# EAGLE design new_design (EAGLE 6.4)
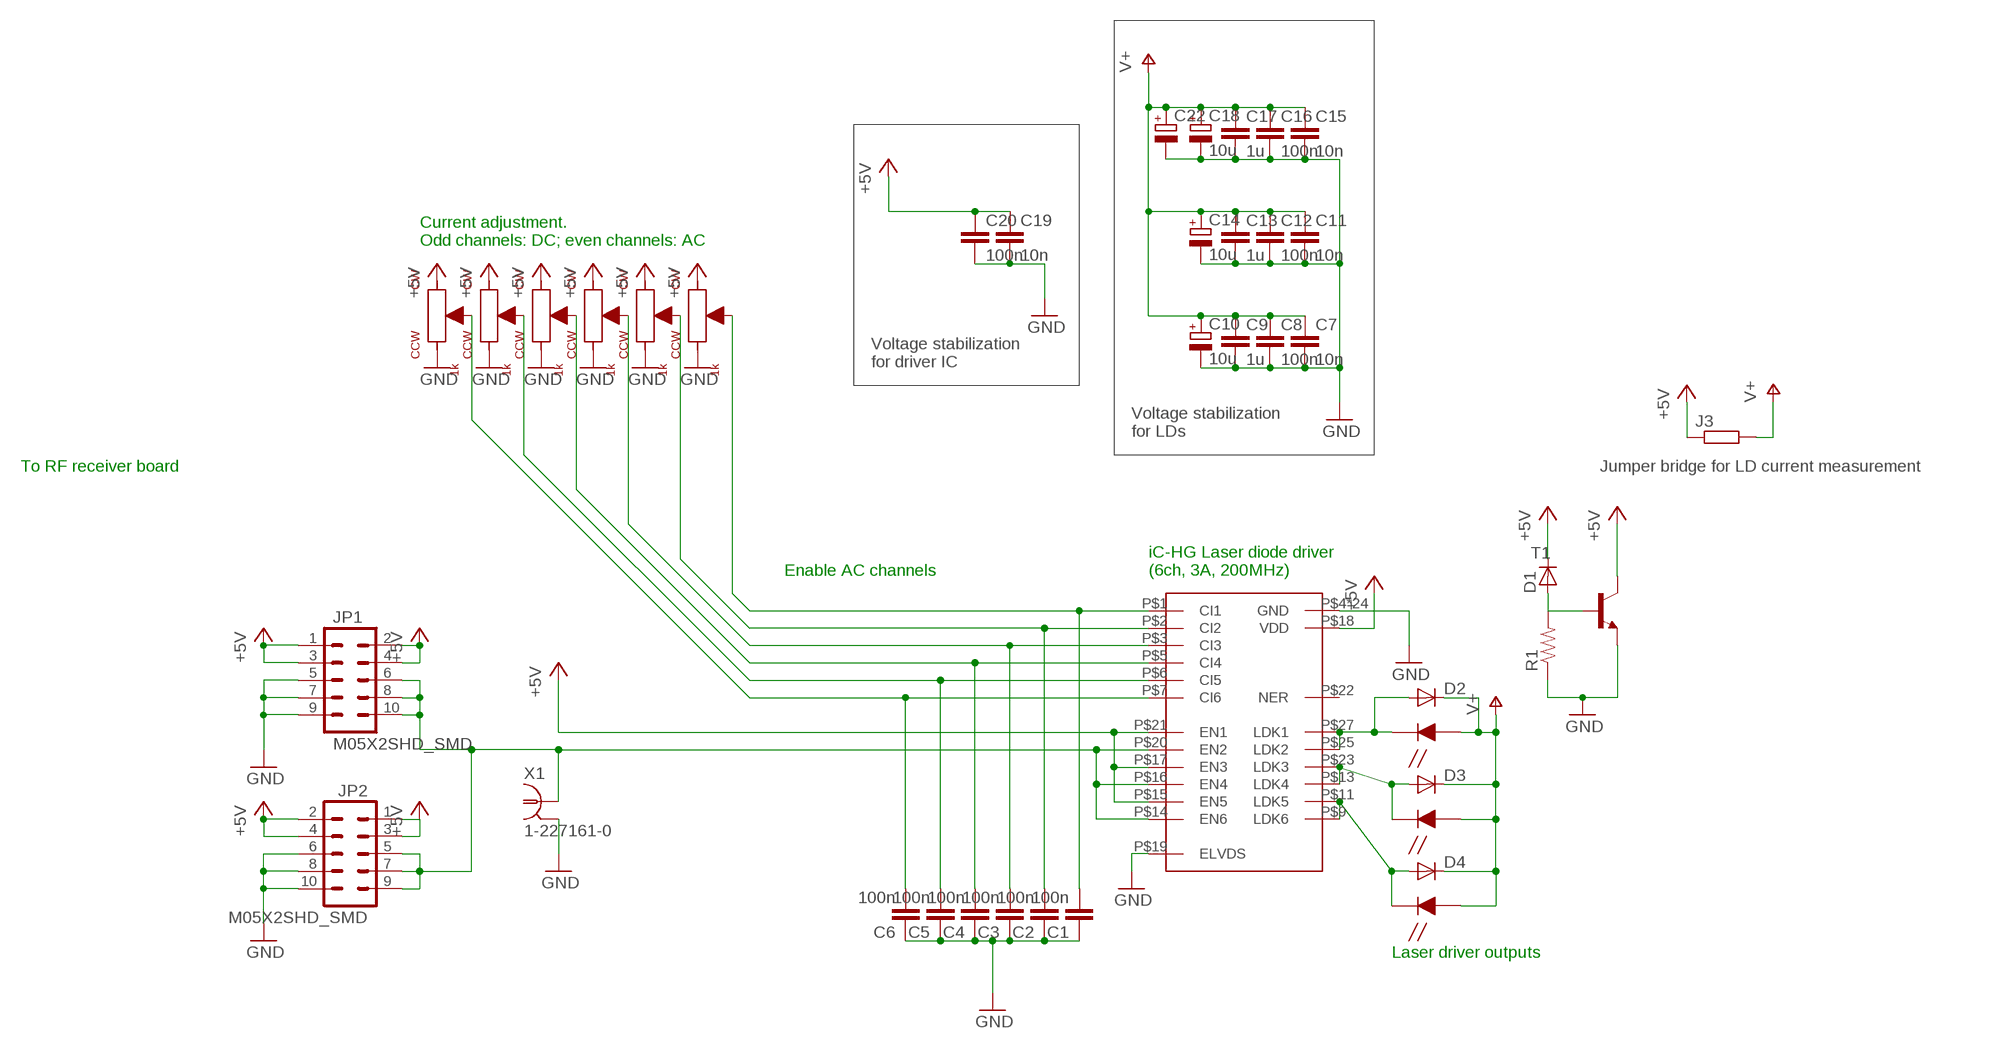
[diagram p0: schematic, sheet 1]

## Parts
C1  100n  C-EUC0402K  [C0402K]
C2  100n  C-EUC0402K  [C0402K]
C3  100n  C-EUC0402K  [C0402K]
C4  100n  C-EUC0402K  [C0402K]
C5  100n  C-EUC0402K  [C0402K]
C6  100n  C-EUC0402K  [C0402K]
C7  10n  C-EUC0402K  [C0402K]
C8  100n  C-EUC0402K  [C0402K]
C9  1u  C-EUC0603  [C0603]
C10  10u  CPOL-EUSMCB  [SMC_B]
C11  10n  C-EUC0402K  [C0402K]
C12  100n  C-EUC0402K  [C0402K]
C13  1u  C-EUC0603  [C0603]
C14  10u  CPOL-EUSMCB  [SMC_B]
C15  10n  C-EUC0402K  [C0402K]
C16  100n  C-EUC0402K  [C0402K]
C17  1u  C-EUC0603  [C0603]
C18  10u  CPOL-EUSMCB  [SMC_B]
C19  10n  C-EUC0402K  [C0402K]
C20  100n  C-EUC0402K  [C0402K]
C22  CPOL-EUCT7343  [CT7343]
D1  D-SMB  [SMB]
D2  DIODE-SOD523  [SOD523]
D3  DIODE-SOD523  [SOD523]
D4  DIODE-SOD523  [SOD523]
IC1  IC-HGTHERMAL  [QFN28-PAD]
J3  R-EU_R1210  [R1210]
JP1  M05X2SHD_SMD  [2X5-SHROUDED_SMD]
JP2  M05X2SHD_SMD  [2X5-SHROUDED_SMD]
LD1  LASER  [LD-FLAT]
LD2  LASER  [LD-FLAT]
LD3  LASER  [LD-FLAT]
P1  1k  TRIMMERPANASONIC_EVM1D  [EVM-1D]
P2  1k  TRIMMERPANASONIC_EVM1D  [EVM-1D]
P3  1k  TRIMMERPANASONIC_EVM1D  [EVM-1D]
P4  1k  TRIMMERPANASONIC_EVM1D  [EVM-1D]
P5  1k  TRIMMERPANASONIC_EVM1D  [EVM-1D]
P6  1k  TRIMMERPANASONIC_EVM1D  [EVM-1D]
R1  RESISTOR0805-RES  [0805]
T1  -NPN-SOT223  [SOT223]
X1  1-227161-0  [AMP_227161]

## Nets
+5V: C19.1 C20.1 D1.1(C) IC1.P$15(EN5) IC1.P$17(EN3) IC1.P$18(VDD) IC1.P$21(EN1) J3.1 JP1.1 JP1.2 JP1.3 JP1.4 JP2.1 JP2.2 JP2.3 JP2.4 P1.CW P2.CW P3.CW P4.CW P5.CW P6.CW T1.4(C)
AC_EN: IC1.P$14(EN6) IC1.P$16(EN4) IC1.P$20(EN2) JP1.6 JP1.8 JP1.10 JP2.5 JP2.7 JP2.9 X1.1
GND: C1.1 C2.1 C3.1 C4.1 C5.1 C6.1 C7.2 C8.2 C9.2 C10.- C11.2 C12.2 C13.2 C14.- C15.2 C16.2 C17.2 C18.- C19.2 C20.2 C22.- IC1.P$4(GND) IC1.P$8(GND) IC1.P$10(GND) IC1.P$12(GND) IC1.P$19(ELVDS) IC1.P$24(GND) IC1.P$26(GND) IC1.P$28(GND) IC1.P$29(GND) IC1.P$30(GND) IC1.P$31(GND) IC1.P$32(GND) IC1.P$33(GND) IC1.P$34(GND) IC1.P$35(GND) IC1.P$36(GND) IC1.P$37(GND) IC1.P$38(GND) IC1.P$39(GND) IC1.P$40(GND) IC1.P$41(GND) IC1.P$42(GND) IC1.P$43(GND) IC1.P$44(GND) IC1.P$45(GND) JP1.5 JP1.7 JP1.9 JP2.6 JP2.8 JP2.10 P1.CCW P2.CCW P3.CCW P4.CCW P5.CCW P6.CCW R1.1 T1.3(E) X1.2
N$1: C2.2 IC1.P$2(CI2) P2.W
N$2: C4.2 IC1.P$5(CI4) P4.W
N$3: C6.2 IC1.P$7(CI6) P6.W
N$5: C1.2 IC1.P$1(CI1) P1.W
N$7: C3.2 IC1.P$3(CI3) P3.W
N$9: C5.2 IC1.P$6(CI5) P5.W
N$11: D4.A IC1.P$9(LDK6) IC1.P$11(LDK5) LD3.C
N$12: D3.A IC1.P$13(LDK4) IC1.P$23(LDK3) LD2.C
N$13: D2.A IC1.P$25(LDK2) IC1.P$27(LDK1) LD1.C
N$14: D1.2(A) R1.2 T1.1(B)
V+: C7.1 C8.1 C9.1 C10.+ C11.1 C12.1 C13.1 C14.+ C15.1 C16.1 C17.1 C18.+ C22.+ D2.C D3.C D4.C J3.2 LD1.A LD2.A LD3.A
Unconnected: IC1.P$22(NER)

## Notes on the sheet
- Current adjustment. 
  Odd channels: DC; even channels: AC
- Voltage stabilization 
  for driver IC
- Voltage stabilization 
  for LDs
- To RF receiver board | Jumper bridge for LD current measurement
- Enable AC channels
- iC-HG Laser diode driver
  (6ch, 3A, 200MHz)
- Laser driver outputs

## Library data of the parts
C1-C9 C11-C13 C15-C17 C19 C20 = rcl:C-EU: CAPACITOR, European symbol
C10 C14 C18 C22 = rcl:CPOL-EU: POLARIZED CAPACITOR, European symbol
D1 = semicon-smd-ipc:D-: DIODE unfilled
D2-D4 = diode:DIODE-: DIODE
IC1 = clockbuffers:IC-HG
J3 = rcl:R-EU_: RESISTOR, European symbol
JP1 JP2 = SparkFun-Connectors_2:M05X2: Header 5x2 Standard 10-pin dual row 0.1" header. Commonly used with AVR-ISP. Use with Spark Fun Electronics SKU: PRT-00778
LD1-LD3 = clockbuffers:LASER
P1-P6 = clockbuffers:TRIMMER
R1 = SparkFun-Resistors:RESISTOR: Resistor Basic schematic elements and footprints for 0603, 1206, and PTH resistors.
T1 = transistor-neu-to92:*-NPN-: NPN Transistror
X1 = con-coax:?227161*: JACK, RIGHT ANGLE, 50 OHM, PCB, BNC Source: amp_227161.pdf; MF: TYCO ELECTRONICS; MPN: 1-227161; OC_FARNELL: unknown; OC_NEWARK: 33B3200

## Board
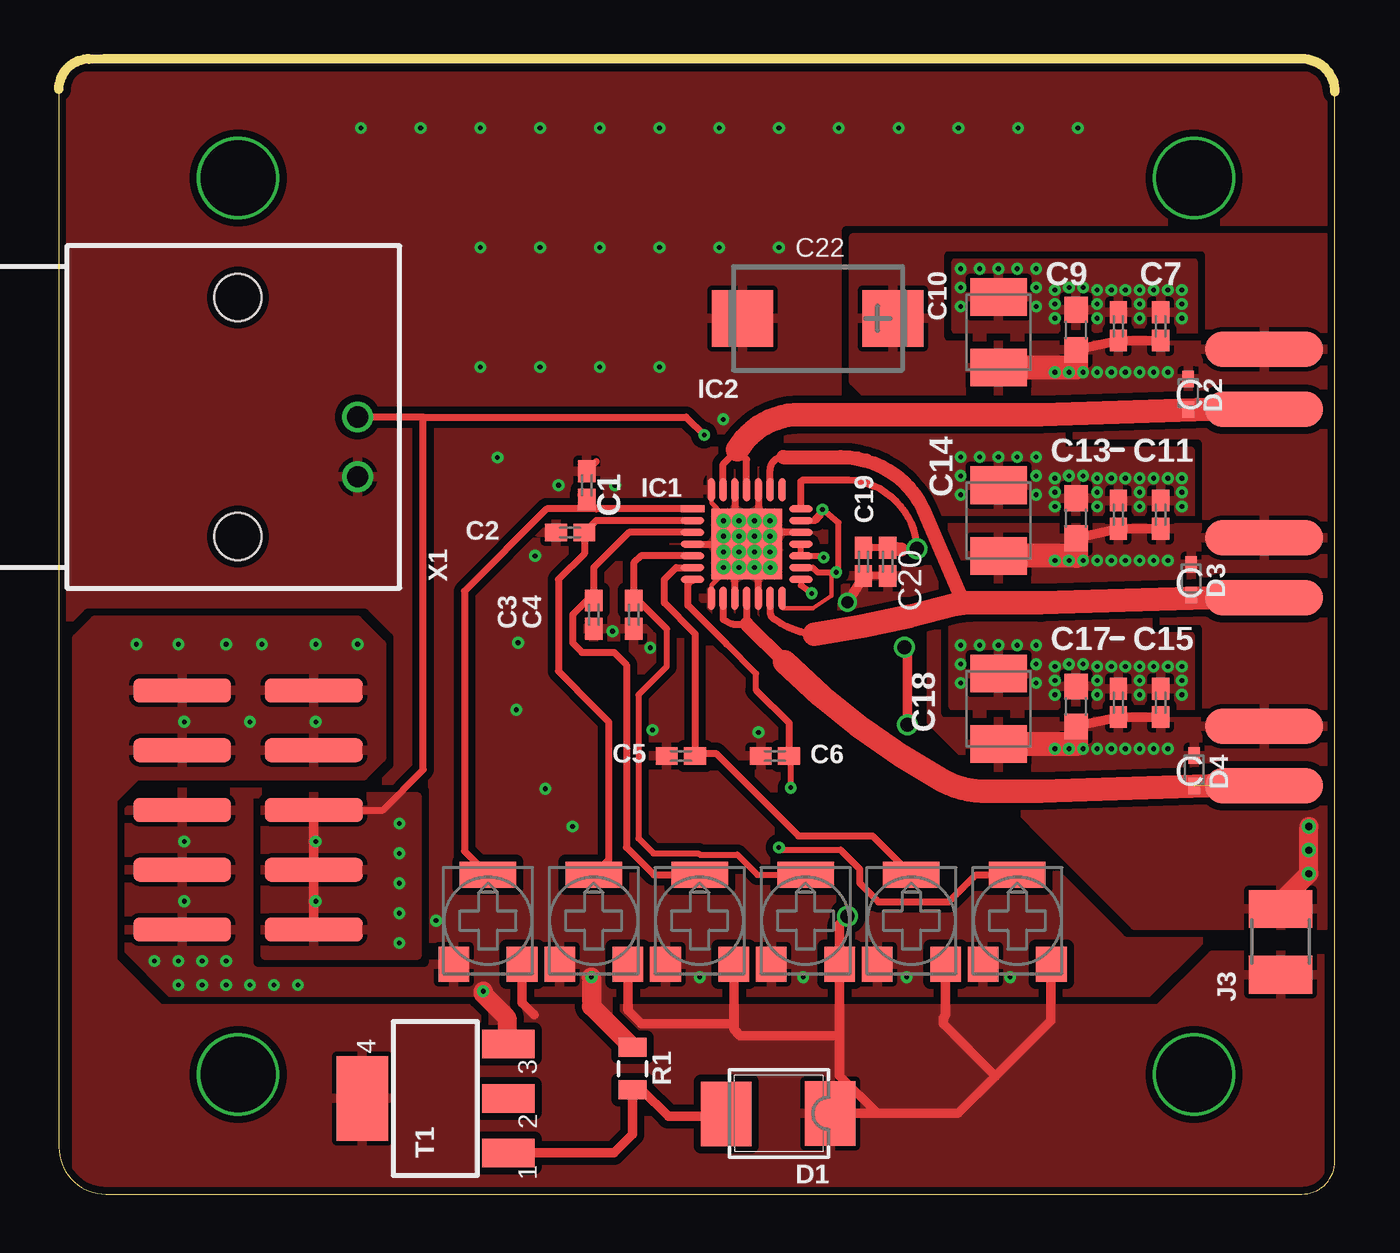
[diagram p1: board, top side]
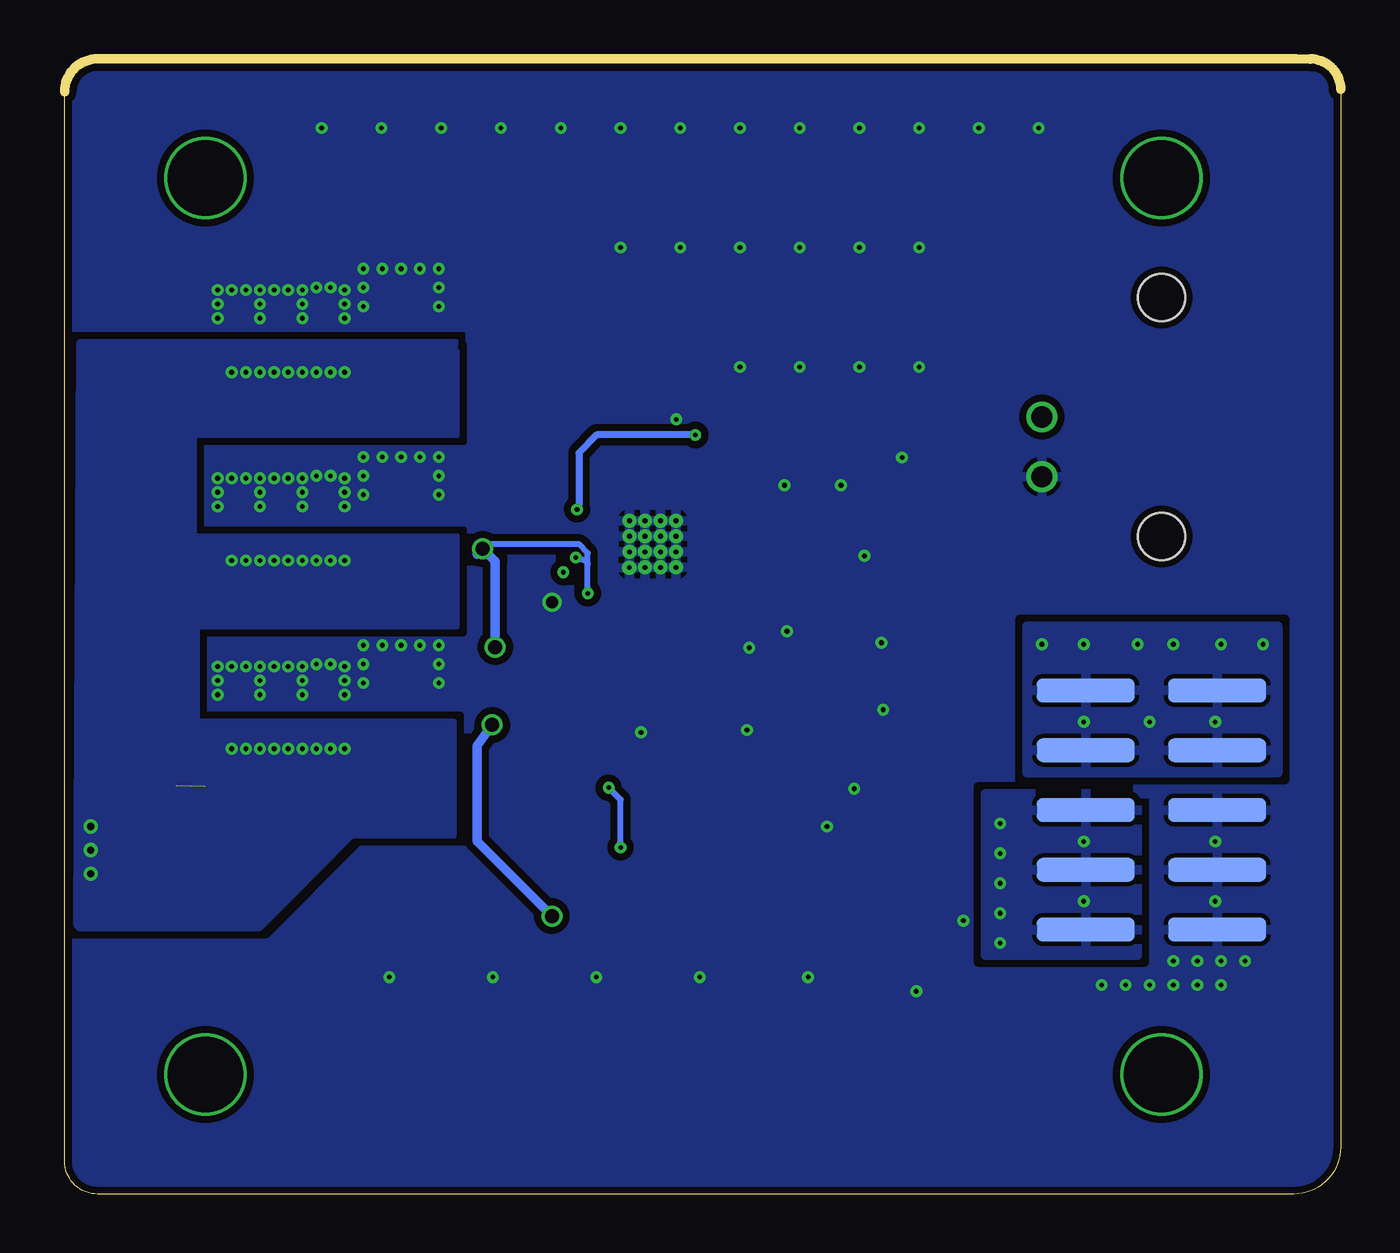
[diagram p2: board, bottom side, seen from below]

Size 54.24 x 48.24 mm. Coordinates in mm from the lower left corner, seen from the top.
Outline: 52.84,48.24 arc-90 54.24,46.84 54.24,1.4 arc-90 52.84,0 2,0 arc-90 0,2 0,46.94 arc-90 1.3,48.24
Outline: 1.3,48.24 1.42,48.24
Outline: 52.85,48.24 1.91,48.24 1.29,48.23
Copper layers (1+2*15+16): Top 0.035mm / dielectric 0.38mm / Route2 0.035mm / dielectric 0.71mm / Route15 0.035mm / dielectric 0.38mm / Bottom 0.035mm
Design rules "PCB-POOL Standard_ML4 *": minimum track width 0.15mm, minimum drill 0.2mm, track to track 0.15mm, track to pad 0.15mm, pad to pad 0.15mm, via to via 0.15mm, smd to smd 0.15mm, copper to edge 0.3mm, drill to drill 0.2mm, minimum pad ring 0.2mm, minimum via ring 0.15mm, stop-mask expansion 0.075mm, vias tented up to drill 8mil, thermal gap 0.2mm

### Footprints (pad centres in the part's own frame; a part is rotated, then mirrored left to right if it is on the bottom)
C0402K = smd 0.925 x 0.74: 1 -0.6,0; 2 0.6,0
C0603 = smd 1.1 x 1: 1 -0.85,0; 2 0.85,0
SMC_B = smd 1.6 x 2.4: + -1.5,0; - 1.5,0
CT7343 = smd 2.6 x 2.4: + -3.2,0; - 3.2,0
SMB = smd 2.159 x 2.743: 1 -2.311,-0.127; 2 2.108,-0.102
SOD523 = smd 0.7 x 0.5: A 0.7,0; C -0.6,0
QFN28-PAD = smd 1 x 0.3: P$1 -2.3,1.5; P$2 -2.3,1; P$3 -2.3,0.5; P$4 -2.3,0; P$5 -2.3,-0.5; P$6 -2.3,-1; P$7 -2.3,-1.5; P$15 2.3,-1.5; P$16 2.3,-1; P$17 2.3,-0.5; P$18 2.3,0; P$19 2.3,0.5; P$20 2.3,1; P$21 2.3,1.5 | smd 0.3 x 1: P$8 -1.5,-2.3; P$9 -1,-2.3; P$10 -0.5,-2.3; P$11 0,-2.3; P$12 0.5,-2.3; P$13 1,-2.3; P$14 1.5,-2.3; P$22 1.5,2.3; P$23 1,2.3; P$24 0.5,2.3; P$25 0,2.3; P$26 -0.5,2.3; P$27 -1,2.3; P$28 -1.5,2.3 | smd 3 x 3: P$29 0,0 | drill 0.2 pad 0.406: P$30 -0.99,0.99; P$31 -0.99,0.33; P$32 -0.99,-0.33; P$33 -0.99,-0.99; P$34 1,-1; P$35 0.99,0.99; P$36 0.33,0.99; P$37 -0.33,0.99; P$38 -0.33,0.33; P$39 -0.33,-0.99; P$40 -0.33,-0.33; P$41 0.33,-0.33; P$42 0.33,-0.99; P$43 0.33,0.33; P$44 0.99,0.33; P$45 0.99,-0.33
R1210 = smd 1.6 x 2.7: 1 -1.4,0; 2 1.4,0
2X5-SHROUDED_SMD = smd 4.15 x 1: 1 -2.794,5.08; 2 2.794,5.08; 3 -2.794,2.54; 4 2.794,2.54; 5 -2.794,0; 6 2.794,0; 7 -2.794,-2.54; 8 2.794,-2.54; 9 -2.794,-5.08; 10 2.794,-5.08
LD-FLAT = smd 5 x 1.5: A 0,1.27; C 0,-1.27
EVM-1D = smd 1.3 x 1.5: CCW -1.45,-1.85; CW 1.45,-1.85 | smd 2.4 x 1.1: W 0,1.95
0805 = smd 0.8 x 1.2: 1 -0.9,0; 2 0.9,0
SOT223 = smd 1.219 x 2.235: 1 -2.311,-3.099; 2 0,-3.099; 3 2.311,-3.099 | smd 3.6 x 2.2: 4 0,3.099
AMP_227161 = drill 0.9 pad 1.27: 1 0,-5.08; 2 -2.54,-5.08 | hole 2: -5.08,0; 5.08,0

### Placement (x,y rotation side)
C1  22.44,30.12 270 top
C2  21.74,28.12 0 top
C3  22.74,24.62 90 top
C4  24.44,24.62 90 top
C5  26.44,18.62 0 top
C6  30.44,18.62 0 top
C7  46.84,36.87 90 top
C8  45.04,36.87 90 top
C9  43.24,36.72 90 top
C10  39.94,36.62 90 top
C11  46.84,28.87 90 top
C12  45.04,28.87 90 top
C13  43.24,28.72 90 top
C14  39.94,28.62 90 top
C15  46.84,20.87 90 top
C16  45.04,20.87 90 top
C17  43.24,20.72 90 top
C18  39.94,20.62 90 top
C19  34.2,26.87 270 top
C20  35.24,26.87 270 top
C22  32.26,37.21 180 top
D1  30.48,3.3 180 top
D2  48.01,34.04 270 top
D3  48.13,26.16 270 top
D4  48.26,18.03 270 top
IC1  29.24,27.62 0 top
J3  51.94,10.72 90 top
JP1  8.04,16.32 0 top
JP2  8.05,16.32 0 bottom
LD1  51.24,34.62 0 top
LD2  51.24,26.62 0 top
LD3  51.24,18.62 0 top
P1  18.24,11.62 0 top
P2  22.74,11.62 0 top
P3  27.24,11.62 0 top
P4  31.74,11.62 0 top
P5  36.24,11.62 0 top
P6  40.74,11.62 0 top
R1  24.38,5.33 270 top
T1  16,4.06 90 top
X1  7.62,33.02 90 top

### Tracks (layer width: path | path; a pad name or v marks a point on that pad's centre or on a via)
+5V  (via drill 0.2, 0.6)
  Top 0.254: IC1.P$15 31.54,25.86 v32,25.53 | IC1.P$18 IC1.P$17 32.32,27.12 v32.51,27.05
  Top 0.3: C20.1 C19.1 | 35.81,27.39 v36.48,27.42
  Top 0.305: IC1.P$21 31.54,30.27 31.62,30.35 33.29,30.35 arc-90 v36.48,27.42
  Top 0.406: D1.1 34.8,3.43 | 34.8,3.43 38.23,3.43 39.81,5.02 | 39.81,5.02 42.16,7.37 42.16,9.74 P6.CW | P5.CW 37.69,7.59 37.59,7.49 37.59,7.24 39.81,5.02 | 33.19,6.6 P4.CW 33.19,11.47 v33.53,11.81 | 33.19,6.6 33.19,5.04 34.8,3.43 | P3.CW 28.69,7.24 | 28.69,7.24 28.69,7 28.96,6.73 33.06,6.73 33.19,6.6 | P2.CW 24.19,7.81 24.77,7.24 28.69,7.24 | P1.CW 19.69,8.12 20.19,7.62 | v36.07,19.94 36.07,23.11 v35.94,23.24
  Top 0.6: C20.1 35.81,27.39
  Bottom 0.254: v32,25.53 32,26.8 | 32,26.8 32,27.24 32.38,27.62 36.02,27.62 v36.48,27.42 | v32.51,27.05 32.13,26.92 32,26.8
  Bottom 0.406: v33.53,11.81 36.7,14.99 36.7,19.05 v36.07,19.94 | 36.7,27.19 v36.48,27.42 35.94,26.89 v35.94,23.24
  other vias: 3.3,23.37 5.08,23.37 7.11,23.37 8.64,23.37 10.92,23.37 12.7,23.37 5.33,20.07 8.13,20.07 10.92,20.07
  pour Top (isolate 0.305): 13.72,23.37 13.72,18.54 12.95,17.78 3.3,17.78 2.29,16.76 2.29,9.91 4.32,7.87 46.74,7.87 49.02,10.16 53.59,10.16 53.59,0.25 0.76,0.51 0.76,23.62 1.52,24.38 12.7,24.38
  pour Bottom (isolate 0.305): 2.67,22.86 2.67,17.91 13.34,17.91 13.34,24.13 2.67,24.13
AC_EN  (via drill 0.2)
  Top 0.2: IC1.P$14 30.79,24.89 32.06,24.89 32.84,25.42 32.84,26.42 | 32.84,26.42 32.24,26.42 31.91,26.62 IC1.P$16 | IC1.P$20 32.04,28.62 v32.46,29.09 | v33.04,26.42 32.84,26.42
  Top 0.254: IC1.P$20 32.18,28.62 32.38,28.83 | 31.91,26.62 32.05,26.62 32.26,26.42 33.15,26.42 33.15,28.53 v32.46,29.09
  Top 0.305: JP1.6 13.78,16.32 15.49,18.03 15.49,33.02 | 15.49,33.02 X1.1 | 15.49,33.02 26.67,33.02 v27.43,32.26
  Top 0.406: JP1.6 JP1.8 JP1.10
  Bottom 0.305: v27.43,32.26 31.62,32.26 32.38,31.5 32.38,29.29 v32.46,29.09
  other vias: 10.92,14.99 10.92,12.45 14.48,15.75 14.48,14.48 14.48,13.21 14.48,11.94 14.48,10.67
  pour Bottom (isolate 0.305): 8.64,17.02 15.11,17.02 15.11,16 15.11,10.16 8.64,10.16
  pour Top (isolate 0.305): 8.76,16.89 15.24,16.89 15.24,14.86 15.24,10.16 8.76,10.16
GND  (via drill 0.2, 0.5)
  Top 0.2: IC1.P$28 27.74,29.37 28.24,28.87 IC1.P$30 | IC1.P$8 27.74,25.87 28.24,26.37 IC1.P$32
  Top 0.3: IC1.P$19 30.74,28.12 IC1.P$36 29.74,29.12 IC1.P$24 | IC1.P$26 28.74,28.37 28.49,28.37 IC1.P$30 | IC1.P$4 27.94,27.62 27.94,27.72 IC1.P$31 28.62,27.25 28.74,27.25 IC1.P$10 | IC1.P$12 29.74,26.25 29.87,26.37 29.99,26.37 IC1.P$34 | C20.2 C19.2
  Top 0.305: C1.1 22.84,31.12
  Top 0.406: C19.2 34.2,26.2 v33.53,25.15
  Top 0.813: IC1.P$40 IC1.P$29 | v22.64,9.22 22.64,7.98 R1.1 | v18.04,8.62 18.04,8.5 19.05,7.49 19.05,6.43 T1.3
  Bottom 0.406: v33.53,25.15 33.66,25.02
  other vias: 42.34,37.22 42.34,37.82 42.34,38.42 42.94,38.52 43.54,38.52 44.14,38.42 44.14,37.82 44.14,37.22 44.74,38.42 45.34,38.42 45.94,38.42 45.94,37.82 45.94,37.22 46.54,38.42 47.14,38.42 47.74,38.42 47.74,37.82 47.74,37.22 38.34,37.72 38.34,38.52 38.34,39.32 39.14,39.32 39.94,39.32 40.74,39.32 41.54,39.32 41.54,38.52 41.54,37.72 42.34,29.22 42.34,29.82 42.34,30.42 42.94,30.52 43.54,30.52 44.14,30.42 44.14,29.82 44.14,29.22 44.74,30.42 45.34,30.42 45.94,30.42 45.94,29.82 45.94,29.22 46.54,30.42 47.14,30.42 47.74,30.42 47.74,29.82 47.74,29.22 38.34,29.72 38.34,30.52 38.34,31.32 39.14,31.32 39.94,31.32 40.74,31.32 41.54,31.32 41.54,30.52 41.54,29.72 42.34,21.22 42.34,21.82 42.34,22.42 42.94,22.52 43.54,22.52 44.14,22.42 44.14,21.82 44.14,21.22 44.74,22.42 45.34,22.42 45.94,22.42 45.94,21.82 45.94,21.22 46.54,22.42 47.14,22.42 47.74,22.42 47.74,21.82 47.74,21.22 38.34,21.72 38.34,22.52 38.34,23.32 39.14,23.32 39.94,23.32 40.74,23.32 41.54,23.32 41.54,22.52 41.54,21.72 19.52,23.43 16.04,11.62 21.84,15.62 23.54,23.92 20.24,27.12 21.24,30.12 29.74,19.62 19.44,20.58 25.24,19.72 27.24,9.22 31.64,9.22 36.04,9.22 40.44,9.22 18.65,31.3 20.46,35.14 23.64,30.12 28.24,32.92 25.14,23.22 5.33,14.99 5.33,12.45 4.06,9.91 5.08,9.91 6.1,9.91 7.11,9.91 5.08,8.89 6.1,8.89 7.11,8.89 8.13,8.89 9.14,8.89 10.16,8.89 12.84,45.3 15.38,45.3 17.92,45.3 20.46,45.3 23,45.3 25.54,45.3 28.08,45.3 30.62,45.3 33.16,45.3 35.7,45.3 38.24,45.3 40.78,45.3 43.32,45.3 17.92,40.22 20.46,40.22 23,40.22 25.54,40.22 28.08,40.22 30.62,40.22 17.92,35.14 23,35.14 25.54,35.14 20.68,17.22
  pour Top (isolate 0.305, rank 3): 0.51,47.5 53.85,47.5 53.85,0.76 0.51,0.51
  pour Bottom (isolate 0.305, rank 2): 0.25,47.75 53.85,47.75 53.85,0.51 0.25,0.51
  pour Top (isolate 0.305): 38.1,39.62 48.26,39.62 48.26,36.7 38.1,36.7
  pour Top (isolate 0.305): 38.1,31.62 48.13,31.62 48.13,28.96 38.1,28.96
  pour Top (isolate 0.305): 37.97,23.75 48.13,23.75 48.13,20.7 37.97,20.7
N$1
  Top 0.3: IC1.P$2 22.84,28.62 C2.2
  Top 0.305: P2.W 23.37,14.2 23.37,20.07 22.04,21.39 22.04,21.42 21.24,22.22 21.24,26.12 22.34,27.22 C2.2
N$2
  Top 0.254: P4.W 29.69,13.57 28.84,14.42 27.24,14.42 27.18,14.48 25.27,14.48 24.64,15.11 24.64,21.21 25.84,22.41 25.84,24.02
  Top 0.3: IC1.P$5 24.74,27.12 24.44,26.82 C4.2
  Top 0.305: C4.2 24.64,25.22 25.84,24.02
N$3  (via drill 0.2)
  Top 0.254: 33.24,14.62 30.72,14.62 v30.61,14.73 | v31.12,17.27 31.12,18.55 C6.2 | 29.64,21.42 29.64,22.12 28.38,23.38
  Top 0.3: 26.94,26.07 IC1.P$7 26.74,25.92 26.74,25.02
  Top 0.305: 33.24,14.62 34.04,13.82 34.04,13.22 34.84,12.42 37.84,12.42 38.99,13.57 P6.W | 26.74,25.02 28.38,23.38 | 29.64,21.42 31.04,20.02 C6.2
  Bottom 0.254: v30.61,14.73 30.61,16.76 v31.12,17.27
N$4  (via drill 3.2)
  other vias: 7.62,43.18
N$5
  Top 0.3: IC1.P$1 22.84,29.12 C1.2
  Top 0.305: 22.84,29.12 20.74,29.12 17.24,25.62 17.24,14.57 P1.W
  Top 0.4: 17.89,13.92 P1.W | 22.24,29.72 C1.2
N$6  (via drill 3.2)
  other vias: 7.62,5.08
N$7
  Top 0.3: IC1.P$3 24.24,28.12 22.74,26.62 C3.2
  Top 0.305: 27.19,13.62 P3.W 25.29,13.57 24.13,14.73 24.13,22.49 23.61,23.02 22.24,23.02 21.84,23.42 21.84,24.62 22.44,25.22 C3.2
N$8  (via drill 3.2)
  other vias: 48.26,43.18
N$9
  Top 0.3: 27.05,23.81 25.74,25.12 25.74,26.12 26.24,26.62 IC1.P$6
  Top 0.305: 27.05,18.73 C5.2 | 27.05,23.81 27.05,18.73 | 27.05,18.73 27.93,18.73 31.44,15.22 34.59,15.22 P5.W
N$10  (via drill 3.2)
  other vias: 48.26,5.08
N$11  (1 unrouted)
  Top 0.3: IC1.P$9 28.24,24.42 28.64,24.22 29.24,24.22 IC1.P$11
  Top 0.6: 29.24,24.22 30.84,22.62
  Top 1: LD3.C 49.49,17.37 41.74,17.12 39.24,17.12 arc-27 37.59,17.57 arc-16 30.84,22.62
N$12
  Top 0.3: IC1.P$23 30.24,30.37 | IC1.P$13 30.24,24.72
  Top 0.305: IC1.P$23 30.24,30.77 arc-90 30.79,31.32 | 30.24,24.72 arc67 30.44,24.42 arc29 32.12,23.79
  Top 0.406: D3.A 48.77,25.46 48.9,25.33
  Top 0.6: 30.79,31.32 33.24,31.32 arc-64 36.74,29.12 38.34,25.37 arc70 38.74,25.12
  Top 1: LD2.C 49.47,25.35 48.9,25.33 41.74,25.12 38.74,25.12 arc13 38.14,25.07 arc-8 32.12,23.79
N$13
  Top 0.3: IC1.P$27 28.24,31.02 28.84,31.62 29.24,31.22 IC1.P$25
  Top 0.406: 31.54,33.12 34.58,33.12 | 48.97,33.35 D2.A
  Top 1: LD1.C 48.97,33.35 41.74,33.12 31.54,33.12 arc61 28.84,31.62
N$14
  Top 0.406: T1.1 23.6,1.75 24.38,2.54 R1.2 24.78,4.43 25.91,3.3 28.27,3.3 D1.2
V+  (via drill 0.2, 0.3)
  Top 0.406: C7.1 C8.1 C9.1 | C13.1 C12.1 C11.1 | C15.1 C16.1 C17.1
  Top 0.813: J3.2 51.94,12.42 v53.14,13.62 v53.14,15.62
  Top 1.016: C9.1 43.24,35.12 C10.+ | C13.1 43.24,27.12 C14.+ | C17.1 43.24,19.12 C18.+
  other vias: 47.14,18.92 46.54,18.92 45.94,18.92 45.34,18.92 44.74,18.92 44.14,18.92 43.54,18.92 42.94,18.92 42.34,18.92 47.14,26.92 46.54,26.92 45.94,26.92 45.34,26.92 44.74,26.92 44.14,26.92 43.54,26.92 42.94,26.92 42.34,26.92 47.14,34.92 46.54,34.92 45.94,34.92 45.34,34.92 44.74,34.92 44.14,34.92 43.54,34.92 42.94,34.92 42.34,34.92 53.14,14.62
  pour Top (isolate 0.305, rank 2): 33.78,40.64 53.85,40.64 53.85,11.43 45.72,11.43 37.08,20.07 37.08,31.24 33.78,34.54
  pour Bottom (isolate 0.305): 37.59,35.81 37.59,32.26 48.77,32.26 48.77,27.94 37.59,27.94 37.59,24.13 48.64,24.13 48.64,20.07 37.72,20.07 37.72,15.24 42.04,15.24 45.97,11.3 53.59,11.3 53.72,11.43 53.59,36.2 37.59,36.2 37.72,35.94

### Text on the board
tNames: IC2 | IC1